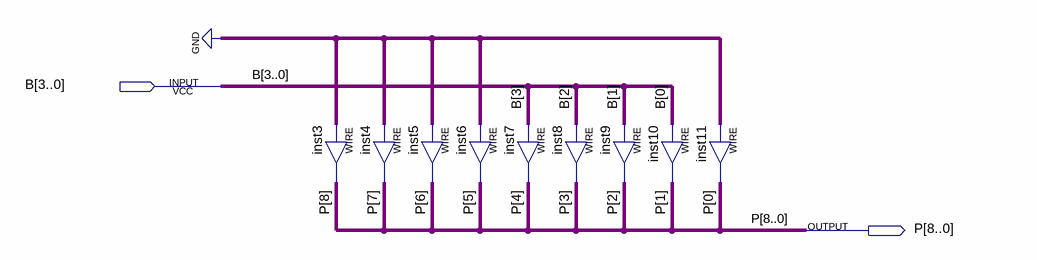
[diagram p0: schematic sheet]
// Quartus schematic makeP.bdf as structural Verilog: 9 symbols, 2 pins
module makeP (
  input  [3:0] B,
  output [8:0] P
);

  assign P[8] = 1'b0;  // WIRE inst3
  assign P[7] = 1'b0;  // WIRE inst4
  assign P[6] = 1'b0;  // WIRE inst5
  assign P[5] = 1'b0;  // WIRE inst6
  assign P[4] = B[3];  // WIRE inst7
  assign P[3] = B[2];  // WIRE inst8
  assign P[2] = B[1];  // WIRE inst9
  assign P[1] = B[0];  // WIRE inst10
  assign P[0] = 1'b0;  // WIRE inst11
endmodule
